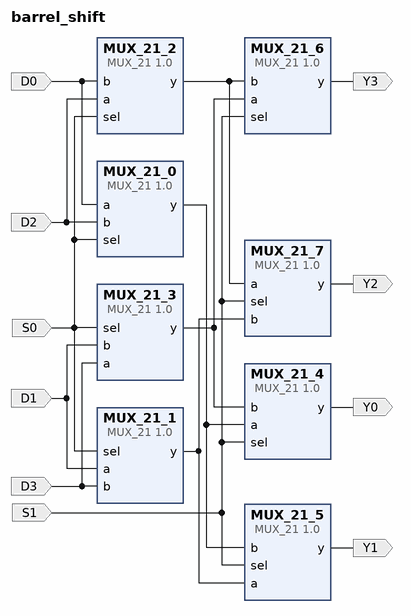
[diagram p0: block diagram of the top level]
# Vivado block design barrel_shift, xc7a35tftg256-1, Vivado 2020.1
create_bd_design barrel_shift

create_bd_port -dir I -type data D1
create_bd_port -dir I -type data D0
create_bd_port -dir I -type data D2
create_bd_port -dir I -type data D3
create_bd_port -dir I -type data S0
create_bd_port -dir I -type data S1
create_bd_port -dir O Y0
create_bd_port -dir O Y1
create_bd_port -dir O Y2
create_bd_port -dir O Y3

create_bd_cell -type ip -vlnv xilinx.com:user:MUX_21:1.0 MUX_21_0
create_bd_cell -type ip -vlnv xilinx.com:user:MUX_21:1.0 MUX_21_1
create_bd_cell -type ip -vlnv xilinx.com:user:MUX_21:1.0 MUX_21_2
create_bd_cell -type ip -vlnv xilinx.com:user:MUX_21:1.0 MUX_21_3
create_bd_cell -type ip -vlnv xilinx.com:user:MUX_21:1.0 MUX_21_4
create_bd_cell -type ip -vlnv xilinx.com:user:MUX_21:1.0 MUX_21_5
create_bd_cell -type ip -vlnv xilinx.com:user:MUX_21:1.0 MUX_21_6
create_bd_cell -type ip -vlnv xilinx.com:user:MUX_21:1.0 MUX_21_7

# ---- connections ----

connect_bd_net [get_bd_ports S0] [get_bd_pins MUX_21_0/sel] [get_bd_pins MUX_21_1/sel] [get_bd_pins MUX_21_2/sel] [get_bd_pins MUX_21_3/sel]
connect_bd_net [get_bd_ports S1] [get_bd_pins MUX_21_4/sel] [get_bd_pins MUX_21_5/sel] [get_bd_pins MUX_21_7/sel] [get_bd_pins MUX_21_6/sel]
connect_bd_net -net D0_1 [get_bd_ports D0] [get_bd_pins MUX_21_0/a] [get_bd_pins MUX_21_2/b]
connect_bd_net -net D1_1 [get_bd_ports D1] [get_bd_pins MUX_21_1/a] [get_bd_pins MUX_21_3/b]
connect_bd_net -net D2_1 [get_bd_ports D2] [get_bd_pins MUX_21_2/a] [get_bd_pins MUX_21_0/b]
connect_bd_net -net D3_1 [get_bd_ports D3] [get_bd_pins MUX_21_3/a] [get_bd_pins MUX_21_1/b]
connect_bd_net [get_bd_pins MUX_21_0/y] [get_bd_pins MUX_21_4/a] [get_bd_pins MUX_21_5/b]
connect_bd_net [get_bd_pins MUX_21_1/y] [get_bd_pins MUX_21_5/a] [get_bd_pins MUX_21_7/b]
connect_bd_net [get_bd_pins MUX_21_2/y] [get_bd_pins MUX_21_7/a] [get_bd_pins MUX_21_6/b]
connect_bd_net [get_bd_pins MUX_21_3/y] [get_bd_pins MUX_21_6/a] [get_bd_pins MUX_21_4/b]
connect_bd_net [get_bd_pins MUX_21_4/y] [get_bd_ports Y0]
connect_bd_net [get_bd_pins MUX_21_5/y] [get_bd_ports Y1]
connect_bd_net [get_bd_pins MUX_21_7/y] [get_bd_ports Y2]
connect_bd_net [get_bd_pins MUX_21_6/y] [get_bd_ports Y3]

validate_bd_design
save_bd_design
